# Altium schematic sheet 02 Mobile Power.SchDoc: Mezzanine Power
size B; Author: JSK; Revision: A; SheetNumber: 2; SheetTotal: 2; AssemblyNumber: ECE453 Power; CurrentDate: 1/09/2018
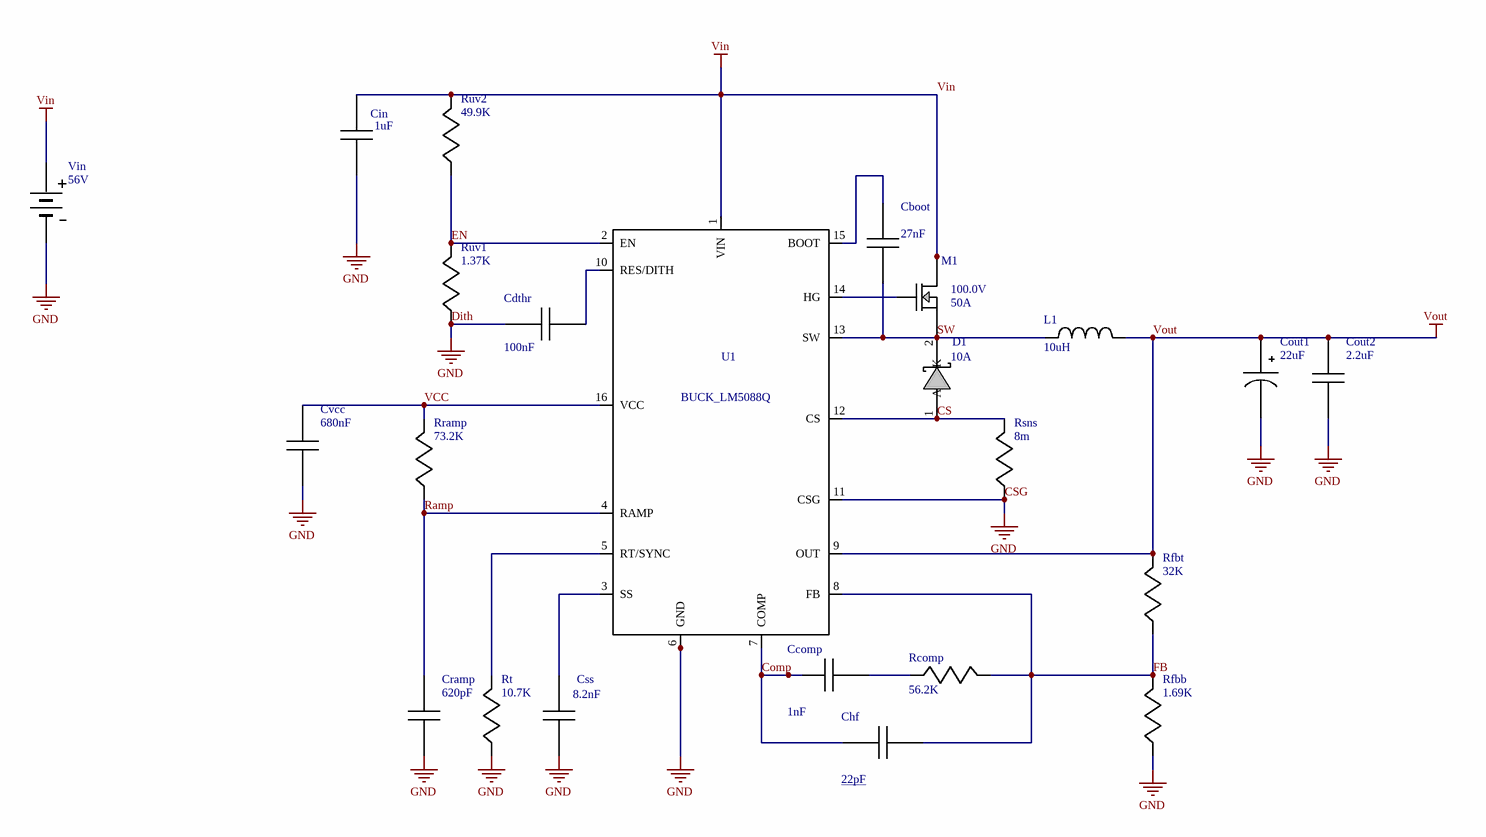
[diagram p0: 02 Mobile Power.SchDoc]

## Parts
Cboot  Capacitance: 27nF  [1812]  (hidden comment: CAP_27nF)
Ccomp  1nF  [0805]
Cdthr  100nF  [0805]
Chf  Capacitance: 22pF  [0805]  (hidden comment: CAP_22pF)
Cin  1uF  [1206_180]
Cout1  22uF  [CAPSMT_62_F61]
Cout2  2.2uF  [0805]
Cramp  620pF  [0805]
Css  8.2nF  [0805]
Cvcc  680nF  [1206]
D1  Current - Average Rectified (Io): 10A  [DPAK]  (hidden comment: DIO_SCHOTT_1655-1099-ND)
L1  10uH  [SER2915]
M1  VdsMax: 100.0V  Current - Continuous Drain (Id) @ 25°C: 50A  [TRANS_NexFET_Q5A]  (hidden comment: MOS_CSD19534Q5A)
Rcomp  56.2K  [0805]
Rfbb  1.69K  [0805]
Rfbt  32K  [0805]
Rramp  73.2K  [0805]
Rsns  8m  [0612]
Rt  10.7K  [0805]
Ruv1  1.37K  [0805]
Ruv2  49.9K  [0805]
U1  BUCK_LM5088Q  [MXA16A]
Vin  56V

## Nets
CSG: Cdthr.2 Cin.2 Cout1.2(-) Cout2.2 Cramp.2 Css.2 Cvcc.2 Rfbb.2 Rsns.2 Rt.2 Ruv1.2 U1.6(GND) U1.11(CSG) U1.17(EP) Vin.2(-)  [also labelled Dith, GND]
Vin: Cin.1 M1.5(Drain) M1.6(Drain) M1.7(Drain) M1.8(Drain) M1.9(Drain) Ruv2.1 U1.1(VIN) Vin.1(+)
Vout: Cout1.1(+) Cout2.1 L1.2 Rfbt.1 U1.9(OUT)
Comp: Ccomp.2 Chf.2 U1.7(COMP)
CS: D1.1(A) D1.3(A) Rsns.1 U1.12(CS)
EN: Ruv1.1 Ruv2.2 U1.2(EN)
FB: Chf.1 Rcomp.1 Rfbb.1 Rfbt.2 U1.8(FB)
Ramp: Cramp.1 Rramp.2 U1.4(RAMP)
SW: Cboot.2 D1.2(K) L1.1 M1.1(Source) M1.2(Source) M1.3(Source) U1.13(SW)
VCC: Cvcc.1 Rramp.1 U1.16(VCC)
NetCboot_1: Cboot.1 U1.15(BOOT)
NetCcomp_1: Ccomp.1 Rcomp.2
NetCdthr_1: Cdthr.1 U1.10(RES/DITH)
NetCss_1: Css.1 U1.3(SS)
NetM1_4: M1.4(Gate) U1.14(HG)
NetRt_1: Rt.1 U1.5(RT/SYNC)

## Notes on the sheet
- Title:
- Size:
- B
- Machine:
- P.C. Board No:
- Assembly No:
- Rev:
- Sheet:
- of
- College of Engineering
- 1415 Engineering Drive
- Madison, WI 53706

## Library data of the parts
Cboot = CAP_27nF: Imported; Manufacturer_Part_Number: C1812C273J5GACTU; Vendor: Kemet; Tolerance: ±5%; Voltage - Rated: 50V; Temperature Coefficient: C0G, NP0; Notification: Current market demand for these product types have resulted in fluctuating and extending lead times. Lead times may differ.; Manufacturer_Name: Kemet; RefDes: RefDes; TYPE: TYPE; Value: Value; Supplier 1: Digi-Key; Manufacturer: KEMET; Manufacturer Part Number: C1812C273J5GACTU; RoHS: RoHS Compliant; Category: Capacitors; Stock 1: 1884; Pricing 1: 1=1.94, 10=1.533, 100=1.1499, 500=0.8688 (USD); Packaging: Cut Tape (CT); Part Status: Active; Operating Temperature: -55°C ~ 125°C; Features: Low ESL; Ratings: -; Applications: General Purpose; Failure Rate: -; Mounting Type: Surface Mount, MLCC; Package / Case: 1812 (4532 Metric); Size / Dimension: 0.177" L x 0.126" W (4.50mm x 3.20mm); Height - Seated (Max): -; Thickness (Max): 0.043" (1.10mm); Lead Spacing: -; Lead Style: -; ComponentLink1URL: https://search.kemet.com/component-edge/download/datasheet/C1812C273J5GACTU.pdf; ComponentLink1Description: https://search.kemet.com/component-edge/download/datasheet/C1812C273J5GACTU.pdf; Supplier Part Number 1: 399-5352-1-ND
Ccomp = CAP_1nF: Imported; Manufacturer_Part_Number: C0805C102K5GACTU; Vendor: Kemet; Tolerance: ±10%; Voltage - Rated: 50V; Temperature Coefficient: C0G, NP0; Notification: Current market demand for these product types have resulted in fluctuating and extending lead times. Lead times may differ.; Manufacturer_Name: Kemet; RefDes: RefDes; TYPE: TYPE; Value: Value; Supplier 1: Digi-Key; Manufacturer: KEMET; Manufacturer Part Number: C0805C102K5GACTU; RoHS: RoHS Compliant; Category: Capacitors; Stock 1: 31421; Pricing 1: 1=0.13, 10=0.09, 100=0.0424, 500=0.02972, 1000=0.02461 (USD); Packaging: Cut Tape (CT); Part Status: Active; Operating Temperature: -55°C ~ 125°C; Features: Low ESL; Ratings: -; Applications: General Purpose; Failure Rate: -; Mounting Type: Surface Mount, MLCC; Package / Case: 0805 (2012 Metric); Size / Dimension: 0.079" L x 0.049" W (2.00mm x 1.25mm); Height - Seated (Max): -; Thickness (Max): 0.035" (0.88mm); Lead Spacing: -; Lead Style: -; ComponentLink1URL: https://search.kemet.com/component-edge/download/datasheet/C0805C102K5GACTU.pdf; ComponentLink1Description: https://search.kemet.com/component-edge/download/datasheet/C0805C102K5GACTU.pdf; Supplier Part Number 1: 399-7988-1-ND; Capacitance: 1nF
Cdthr = CAP_100nF: Imported; Manufacturer_Part_Number: 08053C104JAZ2A; Manufacturer: AVX Corporation; Vendor: AVX; Tolerance: ±5%; Voltage - Rated: 25V; Temperature Coefficient: X7R; Notification: Current market demand for these product types have resulted in fluctuating and extending lead times. Lead times may differ.; Manufacturer_Name: AVX; RefDes: RefDes; TYPE: TYPE; Value: Value; Supplier 1: Digi-Key; Manufacturer Part Number: 08053C104JAZ2A; RoHS: RoHS Compliant; Category: Capacitors; Stock 1: 0; Pricing 1: 4000=0.0864 (USD); Packaging: Tape & Reel (TR); Part Status: Active; Operating Temperature: -55°C ~ 125°C; Features: Soft Termination; Ratings: -; Applications: Boardflex Sensitive; Mounting Type: Surface Mount, MLCC; Package / Case: 0805 (2012 Metric); Size / Dimension: 0.079" L x 0.049" W (2.01mm x 1.25mm); Height - Seated (Max): -; Thickness (Max): 0.037" (0.94mm); Lead Spacing: -; Lead Style: -; ComponentLink1URL: http://datasheets.avx.com/FlexitermMLCC.pdf; ComponentLink1Description: http://datasheets.avx.com/FlexitermMLCC.pdf; Supplier Part Number 1: 08053C104JAZ2A-ND
Chf = CAP_22pF: Imported; Manufacturer_Part_Number: C0805C220K3GACTU; Vendor: Kemet; Tolerance: ±10%; Voltage - Rated: 25V; Temperature Coefficient: C0G, NP0; Notification: Current market demand for these product types have resulted in fluctuating and extending lead times. Lead times may differ.; Manufacturer_Name: Kemet; RefDes: RefDes; TYPE: TYPE; Value: Value; Supplier 1: Digi-Key; Manufacturer: KEMET; Manufacturer Part Number: C0805C220K3GACTU; RoHS: RoHS Compliant; Category: Capacitors; Stock 1: 86290; Pricing 1: 1=0.1, 10=0.072, 100=0.0322, 500=0.02302, 1000=0.01809 (USD); Packaging: Cut Tape (CT); Part Status: Active; Operating Temperature: -55°C ~ 125°C; Features: Low ESL; Ratings: -; Applications: General Purpose; Failure Rate: -; Mounting Type: Surface Mount, MLCC; Package / Case: 0805 (2012 Metric); Size / Dimension: 0.079" L x 0.049" W (2.00mm x 1.25mm); Height - Seated (Max): -; Thickness (Max): 0.035" (0.88mm); Lead Spacing: -; Lead Style: -; ComponentLink1URL: https://search.kemet.com/component-edge/download/datasheet/C0805C220K3GACTU.pdf; ComponentLink1Description: https://search.kemet.com/component-edge/download/datasheet/C0805C220K3GACTU.pdf; Supplier Part Number 1: 399-9190-1-ND
Cin = CAP_1uF: Imported; Manufacturer_Part_Number: C3216X7R2A105K160AA; Manufacturer: TDK Corporation; Vendor: TDK; Tolerance: ±10%; Voltage - Rated: 100V; Temperature Coefficient: X7R; Notification: Current market demand for these product types have resulted in fluctuating and extending lead times. Lead times may differ.; Manufacturer_Name: TDK; RefDes: RefDes; TYPE: TYPE; Value: Value; Supplier 1: Digi-Key; Manufacturer Part Number: C3216X7R2A105K160AA; RoHS: RoHS Compliant; Category: Capacitors; Stock 1: 15982; Pricing 1: 1=0.45, 10=0.316, 100=0.2083, 500=0.15434, 1000=0.13118 (USD); Packaging: Cut Tape (CT); Part Status: Active; Operating Temperature: -55°C ~ 125°C; Features: -; Ratings: -; Applications: General Purpose; Failure Rate: -; Mounting Type: Surface Mount, MLCC; Package / Case: 1206 (3216 Metric); Size / Dimension: 0.126" L x 0.063" W (3.20mm x 1.60mm); Height - Seated (Max): -; Thickness (Max): 0.051" (1.30mm); Lead Spacing: -; Lead Style: -; ComponentLink1URL: https://product.tdk.com/info/en/catalog/datasheets/mlcc_commercial_midvoltage_en.pdf; ComponentLink1Description: https://product.tdk.com/info/en/catalog/datasheets/mlcc_commercial_midvoltage_en.pdf; Supplier Part Number 1: 445-4467-1-ND; Capacitance: 1uF
Cout1 = PCAP_22uF: Imported; Manufacturer_Part_Number: 35SVPF22M; Manufacturer: Panasonic Electronic Components; Vendor: Panasonic; Tolerance: ±20%; ESR (Equivalent Series Resistance): 35 mOhm; Lifetime @ Temp.: 5000 Hrs @ 105°C; Surface Mount Land Size: 0.260" L x 0.260" W (6.60mm x 6.60mm); Manufacturer_Name: Panasonic; RefDes: RefDes; TYPE: TYPE; Value: Value; Supplier 1: Digi-Key; Manufacturer Part Number: 35SVPF22M; RoHS: RoHS Compliant; Category: Capacitors; Stock 1: 16325; Pricing 1: 1=1.32, 10=1.041, 100=0.7811, 500=0.59018 (USD); Packaging: Cut Tape (CT); Part Status: Active; Operating Temperature: -55°C ~ 105°C; Ratings: -; Applications: General Purpose; Lead Spacing: -; Size / Dimension: 0.248" Dia (6.30mm); Height - Seated (Max): 0.236" (6.00mm); Mounting Type: Surface Mount; Package / Case: Radial, Can - SMD; ComponentLink1URL: http://industrial.panasonic.com/www-cgi/jvcr13pz.cgi?E+CI+4+AAB8001+35SVPF22M+8+WW; ComponentLink1Description: http://industrial.panasonic.com/www-cgi/jvcr13pz.cgi?E+CI+4+AAB8001+35SVPF22M+8+WW; Supplier Part Number 1: P16560CT-ND
Cout2 = CAP_2.2uF: Imported; Manufacturer_Part_Number: C2012X7R1H225K125AC; Manufacturer: TDK Corporation; Vendor: TDK; Tolerance: ±10%; Voltage - Rated: 50V; Temperature Coefficient: X7R; Notification: Current market demand for these product types have resulted in fluctuating and extending lead times. Lead times may differ.; Manufacturer_Name: TDK; RefDes: RefDes; TYPE: TYPE; Value: Value; Supplier 1: Digi-Key; Manufacturer Part Number: C2012X7R1H225K125AC; RoHS: RoHS Compliant; Category: Capacitors; Stock 1: 64990; Pricing 1: 1=0.51, 10=0.351, 100=0.2107, 500=0.158, 1000=0.13343 (USD); Packaging: Cut Tape (CT); Part Status: Active; Operating Temperature: -55°C ~ 125°C; Features: Low ESL; Ratings: -; Applications: General Purpose; Failure Rate: -; Mounting Type: Surface Mount, MLCC; Package / Case: 0805 (2012 Metric); Size / Dimension: 0.079" L x 0.049" W (2.00mm x 1.25mm); Height - Seated (Max): -; Thickness (Max): 0.057" (1.45mm); Lead Spacing: -; Lead Style: -; ComponentLink1URL: https://product.tdk.com/info/en/catalog/datasheets/mlcc_commercial_general_en.pdf; ComponentLink1Description: https://product.tdk.com/info/en/catalog/datasheets/mlcc_commercial_general_en.pdf; Supplier Part Number 1: 445-5968-1-ND; Capacitance: 2.2uF
Cramp = CAP_620pF: Imported; Manufacturer_Part_Number: CL21C621JBCNNNC; Vendor: Samsung Electro-Mechanics; Tolerance: ±5%; Voltage - Rated: 50V; Temperature Coefficient: C0G, NP0; Notification: Current market demand for these product types have resulted in fluctuating and extending lead times. Lead times may differ.; Manufacturer_Name: Samsung Electro-Mechanics; RefDes: RefDes; TYPE: TYPE; Value: Value; Supplier 1: Digi-Key; Manufacturer: Samsung Electro-Mechanics; Manufacturer Part Number: CL21C621JBCNNNC; RoHS: RoHS Compliant; Category: Capacitors; Stock 1: 14370; Pricing 1: 1=0.1, 10=0.066, 100=0.0293, 500=0.0209, 1000=0.01643 (USD); Packaging: Cut Tape (CT); Part Status: Active; Operating Temperature: -55°C ~ 125°C; Features: -; Ratings: -; Applications: General Purpose; Mounting Type: Surface Mount, MLCC; Package / Case: 0805 (2012 Metric); Size / Dimension: 0.079" L x 0.049" W (2.00mm x 1.25mm); Height - Seated (Max): -; Thickness (Max): 0.037" (0.95mm); Lead Spacing: -; Lead Style: -; ComponentLink1URL: http://www.samsungsem.com/kr/support/product-search/mlcc/CL21C621JBCNNNC.jsp; ComponentLink1Description: http://www.samsungsem.com/kr/support/product-search/mlcc/CL21C621JBCNNNC.jsp; Supplier Part Number 1: 1276-2677-1-ND
Css = CAP_8.2nF: Imported; Manufacturer: Murata Electronics North America; Manufacturer Part Number: GRM2195C1H822JA01D; Tolerance: ±5%; Voltage - Rated: 50V; Temperature Coefficient: C0G, NP0; Notification: Current market demand for these product types have resulted in fluctuating and extending lead times. Lead times may differ.; Supplier 1: Digi-Key; RoHS: RoHS Compliant; Category: Capacitors; Stock 1: 52724; Pricing 1: 1=0.24, 10=0.167, 100=0.0948, 500=0.06696, 1000=0.05858 (USD); Packaging: Cut Tape (CT); Part Status: Active; Operating Temperature: -55°C ~ 125°C; Features: -; Ratings: -; Applications: General Purpose; Mounting Type: Surface Mount, MLCC; Package / Case: 0805 (2012 Metric); Size / Dimension: 0.079" L x 0.049" W (2.00mm x 1.25mm); Height - Seated (Max): -; Thickness (Max): 0.037" (0.95mm); Lead Spacing: -; Lead Style: -; ComponentLink1URL: https://www.murata.com/~/media/webrenewal/support/library/catalog/products/capacitor/mlcc/c02e.ashx; ComponentLink1Description: https://www.murata.com/~/media/webrenewal/support/library/catalog/products/capacitor/mlcc/c02e.ashx; Supplier Part Number 1: 490-1640-1-ND; Capacitance: 8.2nF
Cvcc = CAP_680nF: Imported; Manufacturer_Part_Number: ECPU1C684MA5; Manufacturer: Panasonic Electronic Components; Manufacturer Part Number: ECP-U1C684MA5; Vendor: Panasonic; Tolerance: ±20%; Voltage Rating - DC: 16V; Dielectric Material: Acrylic, Metallized - Stacked; Manufacturer_Name: Panasonic; RefDes: RefDes; TYPE: TYPE; Value: Value; Supplier 1: Digi-Key; RoHS: RoHS Compliant; Category: Capacitors; Stock 1: 39663; Pricing 1: 1=0.81, 10=0.599, 100=0.4104, 500=0.32492, 1000=0.27362 (USD); Packaging: Cut Tape (CT); Part Status: Active; Voltage Rating - AC: -; Operating Temperature: -40°C ~ 85°C; Mounting Type: Surface Mount; Package / Case: 1206 (3216 Metric); Size / Dimension: 0.126" L x 0.063" W (3.20mm x 1.60mm); Height - Seated (Max): 0.063" (1.60mm); Termination: Solder Pads; Lead Spacing: -; Applications: EMI, RFI Suppression; Ratings: -; Features: Low ESR; ComponentLink1URL: http://industrial.panasonic.com/www-cgi/jvcr13pz.cgi?E+PZ+3+ABD0012+ECPU1C684MA5+7+WW; ComponentLink1Description: http://industrial.panasonic.com/www-cgi/jvcr13pz.cgi?E+PZ+3+ABD0012+ECPU1C684MA5+7+WW; Supplier Part Number 1: PCF1131CT-ND
D1 = DIO_SCHOTT_1655-1099-ND: Imported; Manufacturer: SMC Diode Solutions; Manufacturer Part Number: MBRF10200; Diode Type: Schottky; Speed: Fast Recovery =< 500ns, > 200mA (Io); Supplier 1: Digi-Key; RoHS: RoHS Compliant; Category: Discrete Semiconductor Products; Stock 1: 0; Pricing 1: 1=0.62, 10=0.524, 25=0.4584, 100=0.3928, 250=0.34044, 500=0.28806, 1000=0.22259, 2500=0.20295, 5000=0.18986 (USD); Packaging: Tube; Part Status: Active; Capacitance @ Vr, F: -; Mounting Type: Through Hole; Package / Case: TO-220-2 Insulated, TO-220AC; Supplier Device Package: ITO-220AC; Operating Temperature - Junction: -55°C ~ 175°C; ComponentLink1URL: http://www.smc-diodes.com/propdf/MBRF10200%20N0838%20REV.B.pdf; ComponentLink1Description: http://www.smc-diodes.com/propdf/MBRF10200%20N0838%20REV.B.pdf; Supplier Part Number 1: 1655-1099-ND
L1 = IND_10uH: Imported; Manufacturer_Part_Number: SER2915L-103KL; Vendor: Coilcraft; Inductance: 10; RMS Current (Irms): 30; Inductor Construction: Shielded; Saturation Current (Isat): 13; Product Range: SER2900 Series; Power Inductor Case: 27.9mm x 19.8mm x 15.36; DC Resistance Max: 1650; Inductance Tolerance: ± 10%; SVHC: No SVHC (12-Jan-2017); Automotive Qualification Standard: AEC-Q200; Self Resonant Frequency Min: 20MHz<!--FANDB--><div class="features-and-benefits-container"><div class="features-and-benefits-description"><span class="features-benefits-value">The SER2915L-103KL is a surface mount shielded Power Inductor with ferrite core. This inductor features tin-silver over copper terminations and is resistance to soldering heat maximum three 40 seconds reflows at +260°C, parts cooled to room temperature between cycles. This inductor also features moisture sensitivity level (MSL) of 1, failures in time (FIT)/mean time between failures (MTBF) is 38 per billion hours/26,315,789 hours, calculated per Telcordia SR-332 and tested with pure water or alcohol only foe wash. Peak dc current at which the inductance drops the specified amount from its value without current and inductance measured at 500kHz, 0.1Vrms, 0ADC on an Agilent/HP 4284; Manufacturer_Name: Coilcraft; RefDes: RefDes; TYPE: TYPE; Value: Value; Supplier 1: Farnell; Manufacturer: COILCRAFT; Manufacturer Part Number: SER2915L-103KL; RoHS: YES; Stock 1: 206; Pricing 1: 1=2.7, 250=2.32, 500=1.98 (GBP); Packaging: Each; ComponentLink1URL: http://www.farnell.com/datasheets/1681984.pdf; ComponentLink1Description: http://www.farnell.com/datasheets/1681984.pdf; Supplier Part Number 1: 2288908
M1 = MOS_CSD19534Q5A: Imported; IdsMax: 10.0A; Rdsonat10V: 0.012Ohm; QgTyp: 17nC; Vendor: Texas Instruments; FET Type: N-Channel; Drive Voltage (Max Rds On,  Min Rds On): 6V, 10V; Vgs(th) (Max) @ Id: 3.4V @ 250µA; Vgs (Max): ±20V; Power Dissipation (Max): 3.2W (Ta), 63W (Tc); Rds On (Max) @ Id, Vgs: 15.1 mOhm @ 10A, 10V; Datasheet_URL: http://www.ti.com/lit/ds/symlink/CSD19534Q5A.pdf; Quantity: 1; Manufacturer_Part_Number: CSD19534Q5A; Manufacturer_Name: Texas Instruments; RefDes: RefDes; TYPE: TYPE; Value: Value; Supplier 1: Digi-Key; Manufacturer: Texas Instruments; Manufacturer Part Number: CSD19534Q5A; RoHS: RoHS Compliant; Category: Discrete Semiconductor Products; Stock 1: 307; Pricing 1: 1=1.18, 10=1.043, 100=0.8244, 500=0.63936, 1000=0.50475 (USD); Packaging: Cut Tape (CT); Part Status: Active; Technology: MOSFET (Metal Oxide); FET Feature: -; Operating Temperature: -55°C ~ 150°C (TJ); Mounting Type: Surface Mount; Supplier Device Package: 8-VSON (5x6); Package / Case: 8-PowerTDFN; ComponentLink1URL: http://www.ti.com/lit/ds/symlink/csd19534q5a.pdf; ComponentLink1Description: http://www.ti.com/lit/ds/symlink/csd19534q5a.pdf; Supplier Part Number 1: 296-43636-1-ND
Rcomp = RES_56.2K: Imported; Manufacturer_Part_Number: ERJ-6ENF5622V; Manufacturer: Panasonic Electronic Components; Vendor: Panasonic; Tolerance: ±1%; Power (Watts): 0.125W, 1/8W; Temperature Coefficient: ±100ppm/°C; Manufacturer_Name: Panasonic; RefDes: RefDes; TYPE: TYPE; Value: Value; Supplier 1: Digi-Key; Manufacturer Part Number: ERJ-6ENF5622V; RoHS: RoHS Compliant; Category: Resistors; Stock 1: 45392; Pricing 1: 1=0.1, 10=0.079, 100=0.0305, 1000=0.0134, 2500=0.01157 (USD); Packaging: Cut Tape (CT); Part Status: Active; Composition: Thick Film; Features: Automotive AEC-Q200; Operating Temperature: -55°C ~ 155°C; Package / Case: 0805 (2012 Metric); Supplier Device Package: 0805; Size / Dimension: 0.079" L x 0.049" W (2.00mm x 1.25mm); Height - Seated (Max): 0.028" (0.70mm); Failure Rate: -; ComponentLink1URL: https://industrial.panasonic.com/cdbs/www-data/pdf/RDA0000/AOA0000C304.pdf; ComponentLink1Description: https://industrial.panasonic.com/cdbs/www-data/pdf/RDA0000/AOA0000C304.pdf; Supplier Part Number 1: P56.2KCCT-ND
Rfbb = RES_1.69K: Imported; Manufacturer_Part_Number: ERJ-6ENF1691V; Manufacturer: Panasonic Electronic Components; Vendor: Panasonic; Tolerance: ±1%; Power (Watts): 0.125W, 1/8W; Temperature Coefficient: ±100ppm/°C; Manufacturer_Name: Panasonic; RefDes: RefDes; TYPE: TYPE; Value: Value; Supplier 1: Digi-Key; Manufacturer Part Number: ERJ-6ENF1691V; RoHS: RoHS Compliant; Category: Resistors; Stock 1: 49948; Pricing 1: 1=0.1, 10=0.079, 100=0.0305, 1000=0.0134, 2500=0.01157 (USD); Packaging: Cut Tape (CT); Part Status: Active; Composition: Thick Film; Features: Automotive AEC-Q200; Operating Temperature: -55°C ~ 155°C; Package / Case: 0805 (2012 Metric); Supplier Device Package: 0805; Size / Dimension: 0.079" L x 0.049" W (2.00mm x 1.25mm); Height - Seated (Max): 0.028" (0.70mm); Failure Rate: -; ComponentLink1URL: https://industrial.panasonic.com/cdbs/www-data/pdf/RDA0000/AOA0000C304.pdf; ComponentLink1Description: https://industrial.panasonic.com/cdbs/www-data/pdf/RDA0000/AOA0000C304.pdf; Supplier Part Number 1: P1.69KCCT-ND
Rfbt = RES_32K: Imported; Manufacturer: Vishay Dale; Manufacturer Part Number: TNPW040232K0BEED; Tolerance: ±0.1%; Power (Watts): 0.1W, 1/10W; Temperature Coefficient: ±25ppm/°C; Supplier 1: Digi-Key; RoHS: RoHS Compliant; Category: Resistors; Stock 1: 593; Pricing 1: 1=0.65, 10=0.462, 100=0.2402, 1000=0.12936, 2500=0.1276 (USD); Packaging: Cut Tape (CT); Part Status: Active; Composition: Thin Film; Features: Anti-Sulfur, Automotive AEC-Q200, Moisture Resistant; Operating Temperature: -55°C ~ 155°C; Package / Case: 0402 (1005 Metric); Supplier Device Package: 0402; Size / Dimension: 0.039" L x 0.020" W (1.00mm x 0.50mm); Height - Seated (Max): 0.016" (0.40mm); Failure Rate: -; ComponentLink1URL: http://www.vishay.com/docs/28758/tnpw_e3.pdf; ComponentLink1Description: http://www.vishay.com/docs/28758/tnpw_e3.pdf; Supplier Part Number 1: 541-2115-1-ND
Rramp = RES_73.2K: Imported; Manufacturer_Part_Number: ERJ-6ENF7322V; Manufacturer: Panasonic Electronic Components; Vendor: Panasonic; Tolerance: ±1%; Power (Watts): 0.125W, 1/8W; Temperature Coefficient: ±100ppm/°C; Manufacturer_Name: Panasonic; RefDes: RefDes; TYPE: TYPE; Value: Value; Supplier 1: Digi-Key; Manufacturer Part Number: ERJ-6ENF7322V; RoHS: RoHS Compliant; Category: Resistors; Stock 1: 3056; Pricing 1: 1=0.1, 10=0.079, 100=0.0305, 1000=0.0134, 2500=0.01157 (USD); Packaging: Cut Tape (CT); Part Status: Active; Composition: Thick Film; Features: Automotive AEC-Q200; Operating Temperature: -55°C ~ 155°C; Package / Case: 0805 (2012 Metric); Supplier Device Package: 0805; Size / Dimension: 0.079" L x 0.049" W (2.00mm x 1.25mm); Height - Seated (Max): 0.028" (0.70mm); Failure Rate: -; ComponentLink1URL: https://industrial.panasonic.com/cdbs/www-data/pdf/RDA0000/AOA0000C304.pdf; ComponentLink1Description: https://industrial.panasonic.com/cdbs/www-data/pdf/RDA0000/AOA0000C304.pdf; Supplier Part Number 1: P73.2KCCT-ND
Rsns = RES_8m: Imported; Manufacturer_Part_Number: PRL1632-R008-F-T1; Manufacturer: Susumu; Vendor: Susumu Co Ltd; Tolerance: ±1%; Power (Watts): 1W; Temperature Coefficient: 0/ +350ppm/°C; Manufacturer_Name: Susumu Co Ltd; RefDes: RefDes; TYPE: TYPE; Value: Value; Supplier 1: Digi-Key; Manufacturer Part Number: PRL1632-R008-F-T1; RoHS: RoHS Compliant; Category: Resistors; Stock 1: 11692; Pricing 1: 1=0.65, 10=0.546, 25=0.4676, 50=0.421, 100=0.3664, 250=0.32744, 500=0.26508 (USD); Packaging: Cut Tape (CT); Part Status: Active; Composition: Thin Film; Features: Current Sense; Operating Temperature: -55°C ~ 125°C; Package / Case: Wide 1206 (3216 Metric), 0612; Supplier Device Package: 1206; Size / Dimension: 0.063" L x 0.126" W (1.60mm x 3.20mm); Height - Seated (Max): 0.024" (0.60mm); Failure Rate: -; ComponentLink1URL: http://www.susumu.co.jp/common/pdf/n_catalog_partition07_en.pdf; ComponentLink1Description: http://www.susumu.co.jp/common/pdf/n_catalog_partition07_en.pdf; Supplier Part Number 1: PRL1632.008FCT-ND
Rt = RES_10.7K: Imported; Manufacturer_Part_Number: ERJ-6ENF1072V; Manufacturer: Panasonic Electronic Components; Vendor: Panasonic; Tolerance: ±1%; Power (Watts): 0.125W, 1/8W; Temperature Coefficient: ±100ppm/°C; Manufacturer_Name: Panasonic; RefDes: RefDes; TYPE: TYPE; Value: Value; Supplier 1: Digi-Key; Manufacturer Part Number: ERJ-6ENF1072V; RoHS: RoHS Compliant; Category: Resistors; Stock 1: 71566; Pricing 1: 1=0.1, 10=0.079, 100=0.0305, 1000=0.0134, 2500=0.01157 (USD); Packaging: Cut Tape (CT); Part Status: Active; Composition: Thick Film; Features: Automotive AEC-Q200; Operating Temperature: -55°C ~ 155°C; Package / Case: 0805 (2012 Metric); Supplier Device Package: 0805; Size / Dimension: 0.079" L x 0.049" W (2.00mm x 1.25mm); Height - Seated (Max): 0.028" (0.70mm); Failure Rate: -; ComponentLink1URL: https://industrial.panasonic.com/cdbs/www-data/pdf/RDA0000/AOA0000C304.pdf; ComponentLink1Description: https://industrial.panasonic.com/cdbs/www-data/pdf/RDA0000/AOA0000C304.pdf; Supplier Part Number 1: P10.7KCCT-ND
Ruv1 = RES_1.37K: Imported; Manufacturer_Part_Number: CRCW08051K37FKEA; Manufacturer: Vishay Dale; Vendor: Vishay-Dale; Tolerance: ±1%; Power (Watts): 0.125W, 1/8W; Temperature Coefficient: ±100ppm/°C; Manufacturer_Name: Vishay-Dale; RefDes: RefDes; TYPE: TYPE; Value: Value; Supplier 1: Digi-Key; Manufacturer Part Number: CRCW08051K37FKEA; RoHS: RoHS Compliant; Category: Resistors; Stock 1: 34800; Pricing 1: 1=0.1, 10=0.055, 100=0.0223, 1000=0.01003, 2500=0.0087 (USD); Packaging: Cut Tape (CT); Part Status: Active; Composition: Thick Film; Features: Automotive AEC-Q200; Operating Temperature: -55°C ~ 155°C; Package / Case: 0805 (2012 Metric); Supplier Device Package: 0805; Size / Dimension: 0.079" L x 0.049" W (2.00mm x 1.25mm); Height - Seated (Max): 0.020" (0.50mm); Failure Rate: -; ComponentLink1URL: http://www.vishay.com/docs/20035/dcrcwe3.pdf; ComponentLink1Description: http://www.vishay.com/docs/20035/dcrcwe3.pdf; Supplier Part Number 1: 541-1.37KCCT-ND
Ruv2 = RES_49.9K: Imported; Manufacturer_Part_Number: ERJ-6ENF4992V; Manufacturer: Panasonic Electronic Components; Vendor: Panasonic; Tolerance: ±1%; Power (Watts): 0.125W, 1/8W; Temperature Coefficient: ±100ppm/°C; Manufacturer_Name: Panasonic; RefDes: RefDes; TYPE: TYPE; Value: Value; Supplier 1: Digi-Key; Manufacturer Part Number: ERJ-6ENF4992V; RoHS: RoHS Compliant; Category: Resistors; Stock 1: 218763; Pricing 1: 1=0.1, 10=0.079, 100=0.0305, 1000=0.0134, 2500=0.01157 (USD); Packaging: Cut Tape (CT); Part Status: Active; Composition: Thick Film; Features: Automotive AEC-Q200; Operating Temperature: -55°C ~ 155°C; Package / Case: 0805 (2012 Metric); Supplier Device Package: 0805; Size / Dimension: 0.079" L x 0.049" W (2.00mm x 1.25mm); Height - Seated (Max): 0.028" (0.70mm); Failure Rate: -; ComponentLink1URL: https://industrial.panasonic.com/cdbs/www-data/pdf/RDA0000/AOA0000C304.pdf; ComponentLink1Description: https://industrial.panasonic.com/cdbs/www-data/pdf/RDA0000/AOA0000C304.pdf; Supplier Part Number 1: P49.9KCCT-ND
U1 = BUCK_LM5088QMHX-1/NOP: Imported; Manufacturer_Part_Number: LM5088MHX-2/NOPB; Manufacturer Part Number: LM5088QMHX-1/NOPB; Vendor: Texas Instruments; Output Type: Transistor Driver; Function: Step-Down; Output Configuration: Positive; Topology: Buck; Output Phases: 1; Voltage - Supply (Vcc/Vdd): 4.5 V ~ 75 V; Frequency - Switching: 50kHz ~ 1MHz; Synchronous Rectifier: No; Clock Sync: Yes; Control Features: Enable, Frequency Control, Ramp, Soft Start; Manufacturer_Name: Texas Instruments; RefDes: RefDes; TYPE: TYPE; Value: Value; Supplier 1: Digi-Key; Manufacturer: Texas Instruments; RoHS: RoHS Compliant; Category: Integrated Circuits (ICs); Stock 1: 0; Pricing 1: 2500=1.81625 (USD); Packaging: Tape & Reel (TR); Part Status: Active; Duty Cycle (Max): -; Serial Interfaces: -; Operating Temperature: -40°C ~ 125°C (TJ); Package / Case: 16-TSSOP (0.173", 4.40mm Width) Exposed Pad; Supplier Device Package: 16-HTSSOP; Base Part Number: LM5088; ComponentLink1URL: http://www.ti.com/lit/ds/symlink/lm5088.pdf; ComponentLink1Description: http://www.ti.com/lit/ds/symlink/lm5088.pdf; Supplier Part Number 1: LM5088QMHX-1/NOPB-ND
Vin = WB_BATTERY: Imported; PowerPortType: POWER_GROUND; Value: Value; Manufacturer_Part_Number: WB_BATTERY; Manufacturer_Name: WB_BATTERY; RefDes: RefDes; TYPE: TYPE